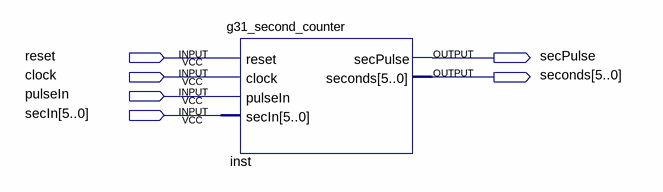
[diagram p0: schematic sheet]
// Quartus schematic g31_second_counter_circuit.bdf as structural Verilog: 1 symbols, 6 pins
module g31_second_counter_circuit (
  input  reset,
  input  clock,
  input  pulseIn,
  input  [5:0] secIn,
  output secPulse,
  output [5:0] seconds
);

  g31_second_counter inst (
    .reset(reset), .clock(clock), .pulseIn(pulseIn), .secIn(secIn), .secPulse(secPulse), .seconds(seconds));
endmodule
